# Altium schematic sheet EEPROM.SchDoc
size A4; SheetNumber: 4; SheetTotal: 8
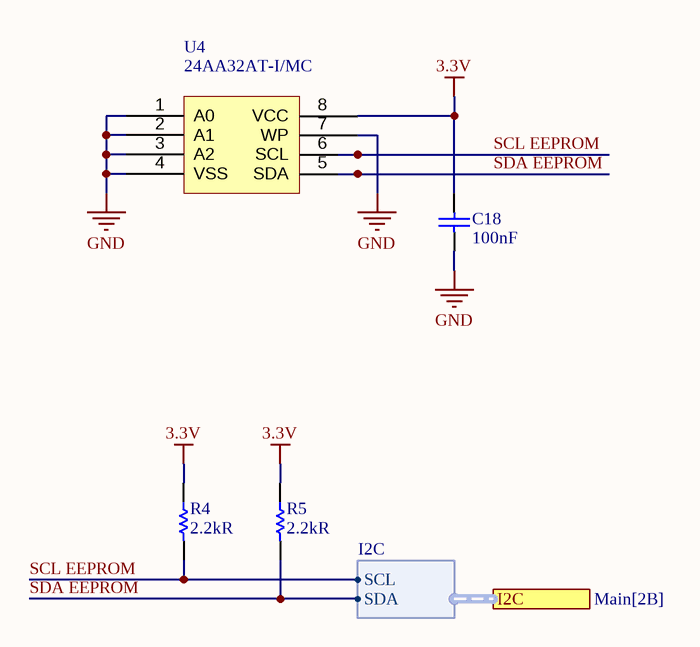
[diagram p0: EEPROM.SchDoc]

## Parts
C18  100nF  [Capacitor 0402]
R4  2.2kR  [Resistor 0402]
R5  2.2kR  [Resistor 0402]
U4  24AA32AT-I/MC  [TDFN-8 2x3mm]

## Ports
I2C (harness I2C, see Main[2B])

## Harnesses
I2C: SCL, SDA

## Nets
3.3V: C18.2 R4.2 R5.2 U4.8(VCC)
GND: C18.1 U4.1(A0) U4.2(A1) U4.3(A2) U4.4(VSS) U4.7(WP)
SCL EEPROM: R4.1 U4.6(SCL) ; port I2C.SCL
SDA EEPROM: R5.1 U4.5(SDA)

## Notes on the sheet
- TITLE
- SIZE
- A4
- VARIANT
- PROJECT
- SHEET
- VERSION
- OF
- AUTHOR
- DATE

## Library data of the parts
C18 = Capacitor
R4 R5 = Resistor
U4 = 24AA32A